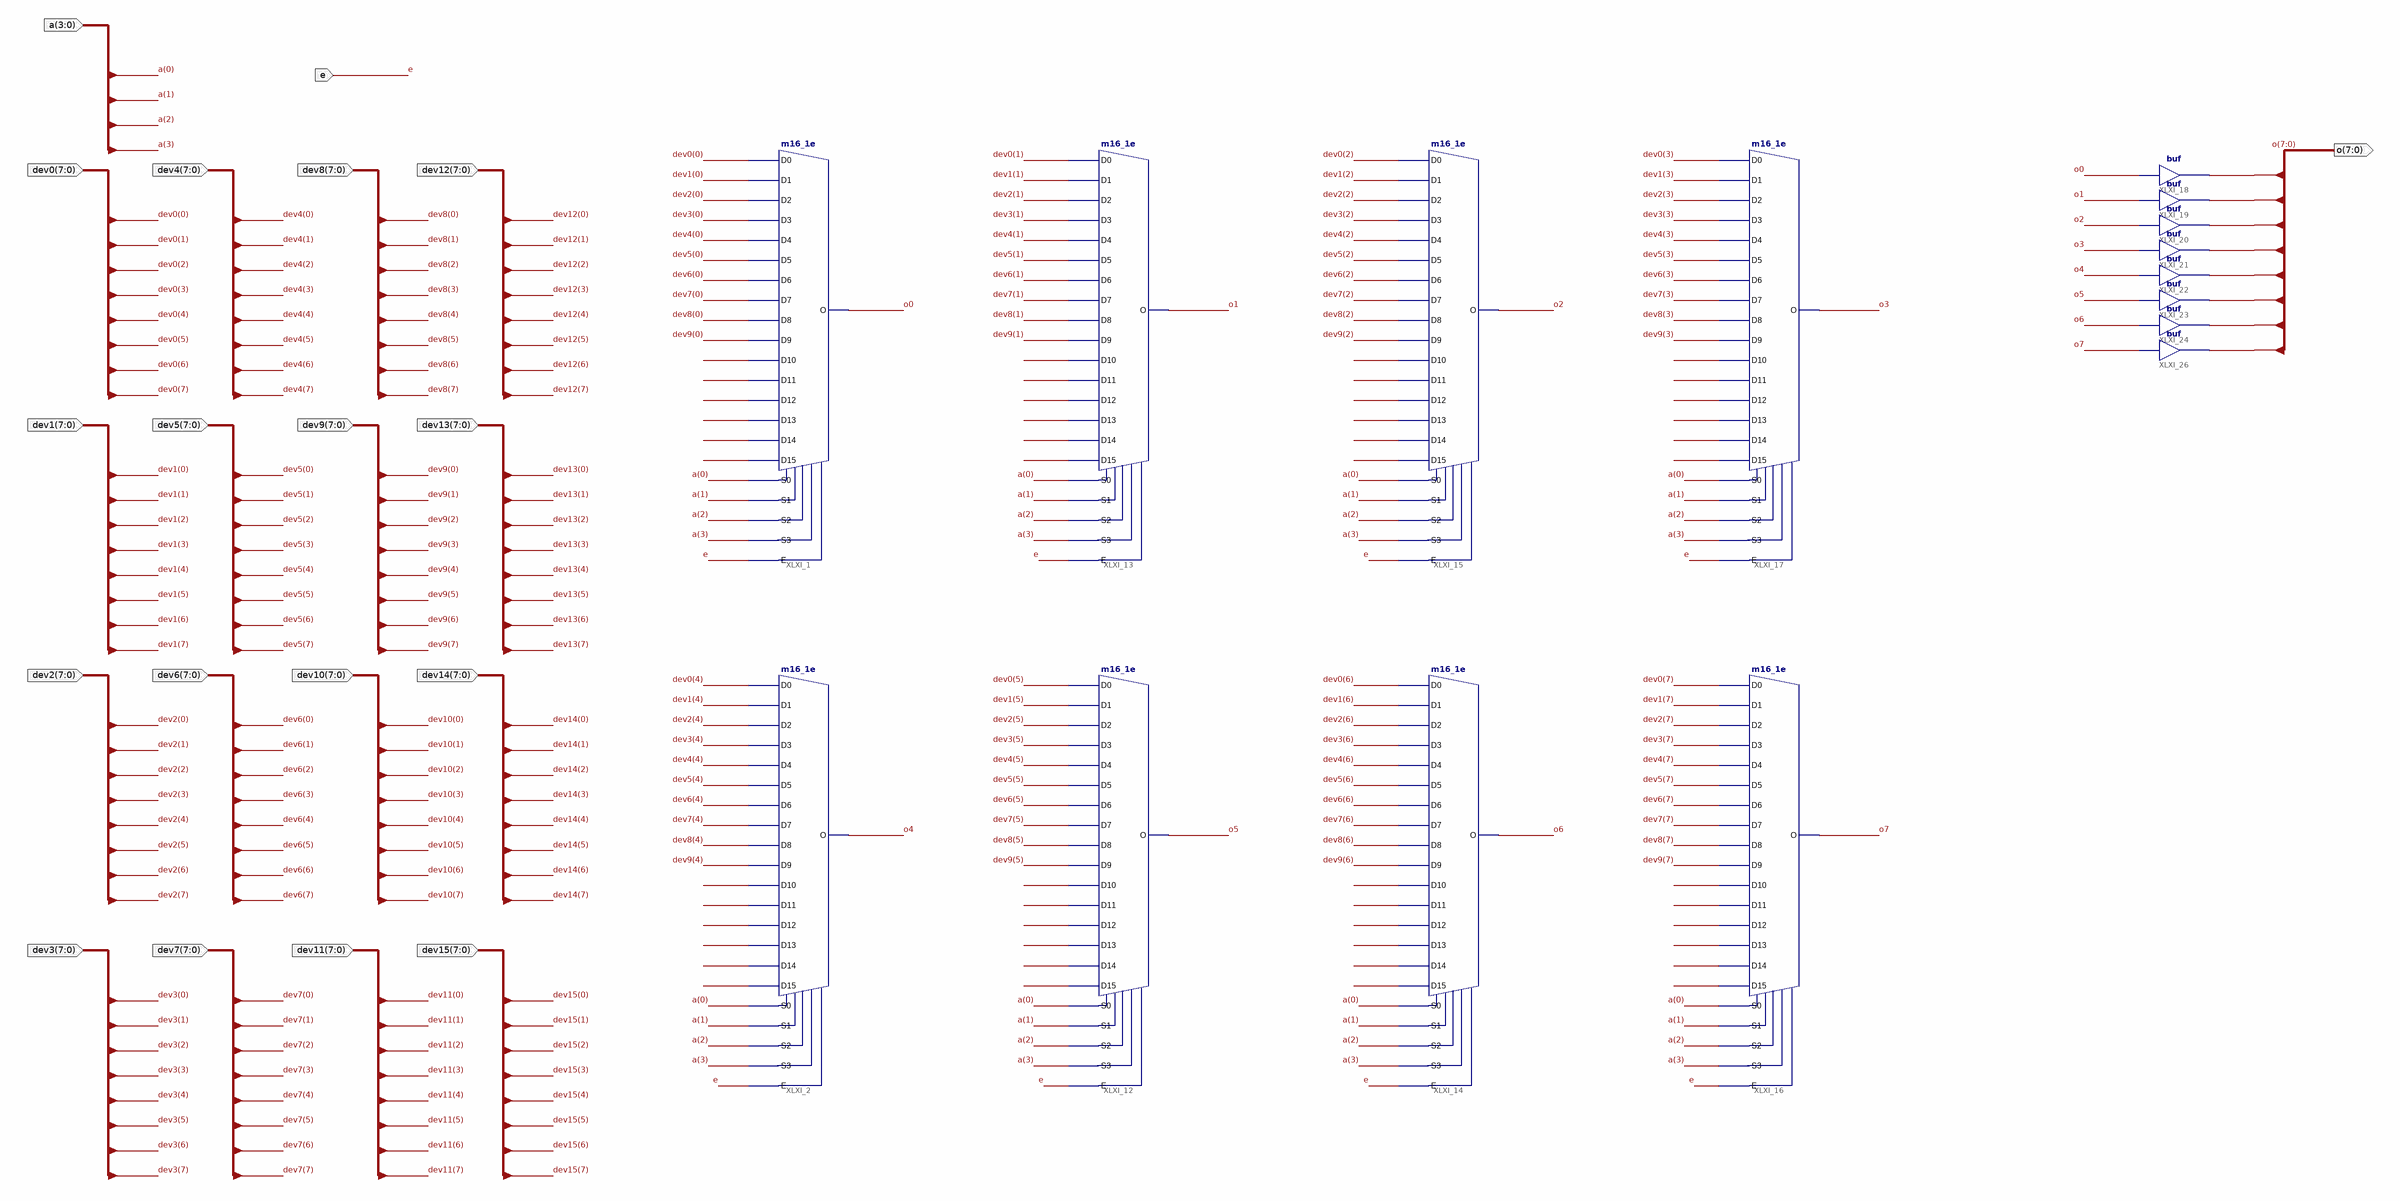
[diagram p0: schematic sheet 1]
// Xilinx ISE schematic bus_muxer.sch (aspartan6) as structural Verilog: 16 symbols, 19 ports
module bus_muxer (
  input  [7:0] dev1,
  input  [7:0] dev0,
  input  [7:0] dev2,
  input  [7:0] dev3,
  input  [7:0] dev4,
  input  [7:0] dev5,
  input  [7:0] dev6,
  input  [7:0] dev7,
  input  [7:0] dev8,
  input  [7:0] dev9,
  input  [7:0] dev10,
  input  [7:0] dev11,
  input  [7:0] dev12,
  input  [7:0] dev13,
  input  [7:0] dev14,
  input  [7:0] dev15,
  input  [3:0] a,
  input  e,
  output [7:0] o
);

  wire o0, o1, o2, o3, o4, o5, o6, o7, XLXN_56, XLXN_57, XLXN_58, XLXN_59, XLXN_60, XLXN_61, XLXN_72,
       XLXN_73, XLXN_74, XLXN_75, XLXN_76, XLXN_77, XLXN_88, XLXN_89, XLXN_90, XLXN_91, XLXN_92, XLXN_93,
       XLXN_104, XLXN_105, XLXN_106, XLXN_107, XLXN_108, XLXN_109, XLXN_120, XLXN_121, XLXN_122, XLXN_123,
       XLXN_124, XLXN_125, XLXN_136, XLXN_137, XLXN_138, XLXN_139, XLXN_140, XLXN_141, XLXN_152, XLXN_153,
       XLXN_154, XLXN_155, XLXN_156, XLXN_157, XLXN_168, XLXN_169, XLXN_170, XLXN_171, XLXN_172, XLXN_173;

  buf XLXI_18 (o[0], o0);
  buf XLXI_19 (o[1], o1);
  buf XLXI_20 (o[2], o2);
  buf XLXI_21 (o[3], o3);
  buf XLXI_22 (o[4], o4);
  buf XLXI_23 (o[5], o5);
  buf XLXI_24 (o[6], o6);
  buf XLXI_26 (o[7], o7);
  m16_1e XLXI_2 (
    .D0(dev0[4]), .D1(dev1[4]), .D10(XLXN_72), .D11(XLXN_73), .D12(XLXN_74), .D13(XLXN_75), .D14(XLXN_76),
    .D15(XLXN_77), .D2(dev2[4]), .D3(dev3[4]), .D4(dev4[4]), .D5(dev5[4]), .D6(dev6[4]), .D7(dev7[4]),
    .D8(dev8[4]), .D9(dev9[4]), .E(e), .S0(a[0]), .S1(a[1]), .S2(a[2]), .S3(a[3]), .O(o4));
  m16_1e XLXI_1 (
    .D0(dev0[0]), .D1(dev1[0]), .D10(XLXN_56), .D11(XLXN_57), .D12(XLXN_58), .D13(XLXN_59), .D14(XLXN_60),
    .D15(XLXN_61), .D2(dev2[0]), .D3(dev3[0]), .D4(dev4[0]), .D5(dev5[0]), .D6(dev6[0]), .D7(dev7[0]),
    .D8(dev8[0]), .D9(dev9[0]), .E(e), .S0(a[0]), .S1(a[1]), .S2(a[2]), .S3(a[3]), .O(o0));
  m16_1e XLXI_12 (
    .D0(dev0[5]), .D1(dev1[5]), .D10(XLXN_104), .D11(XLXN_105), .D12(XLXN_106), .D13(XLXN_107),
    .D14(XLXN_108), .D15(XLXN_109), .D2(dev2[5]), .D3(dev3[5]), .D4(dev4[5]), .D5(dev5[5]), .D6(dev6[5]),
    .D7(dev7[5]), .D8(dev8[5]), .D9(dev9[5]), .E(e), .S0(a[0]), .S1(a[1]), .S2(a[2]), .S3(a[3]), .O(o5));
  m16_1e XLXI_13 (
    .D0(dev0[1]), .D1(dev1[1]), .D10(XLXN_88), .D11(XLXN_89), .D12(XLXN_90), .D13(XLXN_91), .D14(XLXN_92),
    .D15(XLXN_93), .D2(dev2[1]), .D3(dev3[1]), .D4(dev4[1]), .D5(dev5[1]), .D6(dev6[1]), .D7(dev7[1]),
    .D8(dev8[1]), .D9(dev9[1]), .E(e), .S0(a[0]), .S1(a[1]), .S2(a[2]), .S3(a[3]), .O(o1));
  m16_1e XLXI_14 (
    .D0(dev0[6]), .D1(dev1[6]), .D10(XLXN_136), .D11(XLXN_137), .D12(XLXN_138), .D13(XLXN_139),
    .D14(XLXN_140), .D15(XLXN_141), .D2(dev2[6]), .D3(dev3[6]), .D4(dev4[6]), .D5(dev5[6]), .D6(dev6[6]),
    .D7(dev7[6]), .D8(dev8[6]), .D9(dev9[6]), .E(e), .S0(a[0]), .S1(a[1]), .S2(a[2]), .S3(a[3]), .O(o6));
  m16_1e XLXI_15 (
    .D0(dev0[2]), .D1(dev1[2]), .D10(XLXN_120), .D11(XLXN_121), .D12(XLXN_122), .D13(XLXN_123),
    .D14(XLXN_124), .D15(XLXN_125), .D2(dev2[2]), .D3(dev3[2]), .D4(dev4[2]), .D5(dev5[2]), .D6(dev6[2]),
    .D7(dev7[2]), .D8(dev8[2]), .D9(dev9[2]), .E(e), .S0(a[0]), .S1(a[1]), .S2(a[2]), .S3(a[3]), .O(o2));
  m16_1e XLXI_16 (
    .D0(dev0[7]), .D1(dev1[7]), .D10(XLXN_168), .D11(XLXN_169), .D12(XLXN_170), .D13(XLXN_171),
    .D14(XLXN_172), .D15(XLXN_173), .D2(dev2[7]), .D3(dev3[7]), .D4(dev4[7]), .D5(dev5[7]), .D6(dev6[7]),
    .D7(dev7[7]), .D8(dev8[7]), .D9(dev9[7]), .E(e), .S0(a[0]), .S1(a[1]), .S2(a[2]), .S3(a[3]), .O(o7));
  m16_1e XLXI_17 (
    .D0(dev0[3]), .D1(dev1[3]), .D10(XLXN_152), .D11(XLXN_153), .D12(XLXN_154), .D13(XLXN_155),
    .D14(XLXN_156), .D15(XLXN_157), .D2(dev2[3]), .D3(dev3[3]), .D4(dev4[3]), .D5(dev5[3]), .D6(dev6[3]),
    .D7(dev7[3]), .D8(dev8[3]), .D9(dev9[3]), .E(e), .S0(a[0]), .S1(a[1]), .S2(a[2]), .S3(a[3]), .O(o3));
endmodule
